# Altium schematic sheet Power.SchDoc
size A2
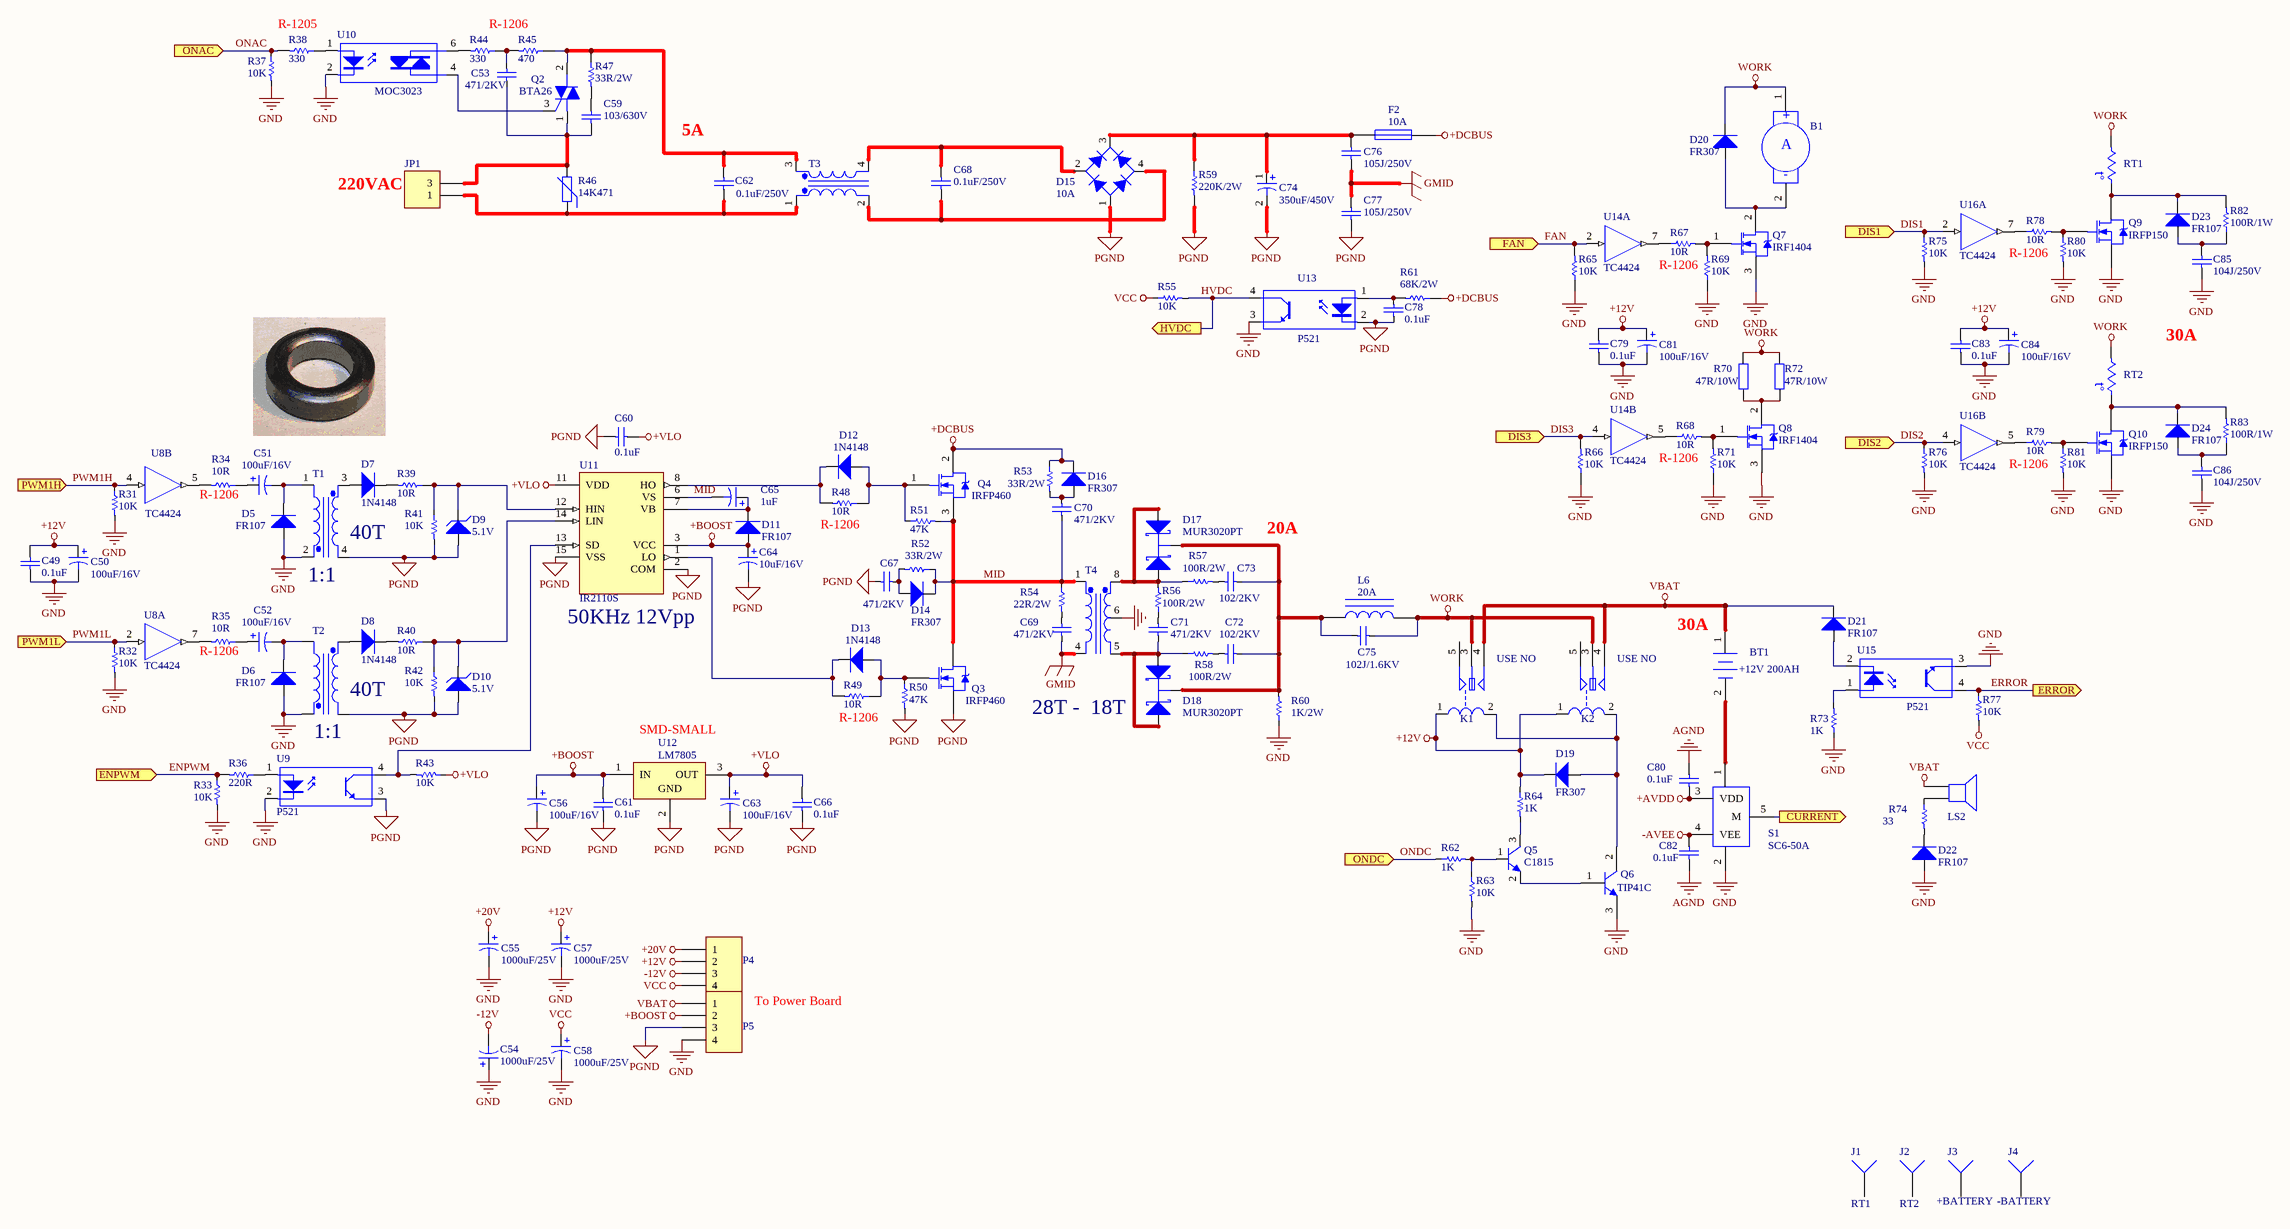
[diagram p0: Power.SchDoc]

## Parts
B1  COOLER  [H2-15A]  (value not drawn)
BT1  value +12V 200AH  [H2-15A]  (hidden comment: Battery)
C49  0.1uF  [C0805]
C50  100uF/16V  [C107-SMD]
C51  100uF/16V  [CAP-100UF/16V]
C52  100uF/16V  [CAP-100UF/16V]
C53  471/2KV  [CAP2/3]
C54  1000uF/25V  [C-400]
C55  1000uF/25V  [C-400]
C56  100uF/16V  [C107-SMD]
C57  1000uF/25V  [C-400]
C58  1000uF/25V  [C-400]
C59  103/630V  [CAP2/3]
C60  0.1uF  [C0805]
C61  0.1uF  [R0805]
C62  0.1uF/250V  [CAP-105J/250V]
C63  100uF/16V  [C107-SMD]
C64  10uF/16V  [C106-SMD]
C65  1uF  [C106-SMD]
C66  0.1uF  [R0805]
C67  471/2KV  [CAP2/3]
C68  0.1uF/250V  [CAP-105J/250V]
C69  471/2KV  [CAP2/3]
C70  471/2KV  [CAP2/3]
C71  471/2KV  [CAP2/3]
C72  102/2KV  [CAP2/3]
C73  102/2KV  [CAP2/3]
C74  350uF/450V  [CAP-330uH-450V]
C75  102J/1.6KV  [CAP200]
C76  105J/250V  [CAP800]
C77  105J/250V  [CAP800]
C78  0.1uF  [C0805]
C79  0.1uF  [C0805]
C80  0.1uF  [R0805]
C81  100uF/16V  [C107-SMD]
C82  0.1uF  [R0805]
C83  0.1uF  [C0805]
C84  100uF/16V  [C107-SMD]
C85  104J/250V  [CAP2/3]
C86  104J/250V  [CAP2/3]
D5  FR107  [DIODE-1A/300]
D6  FR107  [DIODE-1A/300]
D7  1N4148  [1N4148-SMD]
D8  1N4148  [1N4148-SMD]
D9  5.1V  [1N4148]
D10  5.1V  [1N4148]
D11  FR107  [DIODE-1A/300]
D12  1N4148  [1N4148-SMD]
D13  1N4148  [1N4148-SMD]
D14  FR307  [FR307]
D15  10A  [DB-10A]
D16  FR307  [FR307]
D17  MUR3020PT  [TO-247-OUTLINE]
D18  MUR3020PT  [TO-247-OUTLINE]
D19  FR307  [FR307]
D20  FR307  [FR307]
D21  FR107  [DIODE-1A/300]
D22  FR107  [DIODE-1A/300]
D23  FR107  [DIODE-1A/300]
D24  FR107  [DIODE-1A/300]
F2  10A  [FUSE-DC]
J1  RT1  [M4-ON]
J2  RT2  [M4-ON]
J3  +BATTERY  [M4-ON]
J4  -BATTERY  [M4-ON]
JP1  AC in  [H3-15A]  (value not drawn)
K1  RELAY30A  [RELAY30A]  (value not drawn)
K2  RELAY30A  [RELAY30A]  (value not drawn)
L6  value 20A  [IND-10A]  (hidden comment: Inductor Iron)
LS2  Speaker  [BEEPER]  (value not drawn)
P4  Header 4  [H4-15A]  (value not drawn)
P5  Header 4  [H4-15A]  (value not drawn)
Q2  BTA26  [TOP3]
Q3  IRFP460  [TO-247-OUTLINE]
Q4  IRFP460  [TO-247-OUTLINE]
Q5  C1815  [SOT-23]
Q6  TIP41C  [TO-220-FULL OUTLINE]
Q7  IRF1404  [TO-220-FULL OUTLINE]
Q8  IRF1404  [TO-220-FULL OUTLINE]
Q9  IRFP150  [TO-247-OUTLINE]
Q10  IRFP150  [TO-247-OUTLINE]
R31  10K  [R0805]
R32  10K  [R0805]
R33  10K  [R0805]
R34  10R  [R0805]
R35  10R  [R0805]
R36  220R  [R0805]
R37  10K  [R0805]
R38  330  [R0805]
R39  10R  [R0805]
R40  10R  [R0805]
R41  10K  [R0805]
R42  10K  [R0805]
R43  10K  [R0805]
R44  330  [R0805]
R45  470  [R0805]
R46  14K471  [MOV471]
R47  33R/2W  [RES-2W/200]
R48  10R  [R0805]
R49  10R  [R0805]
R50  47K  [R0805]
R51  47K  [R0805]
R52  33R/2W  [RES-2W/200]
R53  33R/2W  [RES-2W/200]
R54  22R/2W  [RES-2W/200]
R55  10K  [R0805]
R56  100R/2W  [RES-2W/200]
R57  100R/2W  [RES-2W/400]
R58  100R/2W  [RES-2W/400]
R59  220K/2W  [RES-2W/400]
R60  1K/2W  [RES-2W/200]
R61  68K/2W  [RES-2W/400]
R62  1K  [R0805]
R63  10K  [R0805]
R64  1K  [R0805]
R65  10K  [R0805]
R66  10K  [R0805]
R67  10R  [R1206]
R68  10R  [R1206]
R69  10K  [R0805]
R70  47R/10W  [RES-10W]
R71  10K  [R0805]
R72  47R/10W  [RES-10W]
R73  1K  [R0805]
R74  33  [R0805]
R75  10K  [R0805]
R76  10K  [R0805]
R77  10K  [R0805]
R78  10R  [R1206]
R79  10R  [R1206]
R80  10K  [R0805]
R81  10K  [R0805]
R82  100R/1W  [RES-1W/110]
R83  100R/1W  [RES-1W/110]
RT1  Res Thermal  [H2-15A]  (value not drawn)
RT2  Res Thermal  [H2-15A]  (value not drawn)
S1  SC6-50A  [SC6-50A]
T1  Trans Cupl  [TRANS-Driver]  (value not drawn)
T2  Trans Cupl  [TRANS-Driver]  (value not drawn)
T3  Filter AC  [IND-10A-4PIN]  (value not drawn)
T4  Trans CT Ideal  [TRANS-F]  (value not drawn)
U8  TC4424  [8-SOIC_751]  (parts A,B of 2)
U9  P521  [DIP-4]
U10  MOC3023  [DIP-6/300]
U11  IR2110S  [SOIC16_N]
U12  LM7805  [78M05-SMD]
U13  P521  [DIP-4]
U14  TC4424  [8-SOIC_751]  (parts A,B of 2)
U15  P521  [DIP-4]
U16  TC4424  [8-SOIC_751]  (parts A,B of 2)

## Ports
CURRENT (out), DIS1 (in), DIS2 (in), DIS3 (in), ENPWM (in), ERROR (out), FAN (in), HVDC (out), ONAC (in), ONDC (in), PWM1H (in), PWM1L (in)

## Nets
+12V: C49.1 C50.1 C57.1 C79.1 C81.1 C83.1 C84.1 D19.2(K) K1.1(V1) K2.1(V1) P4.2 R64.1 U8.6(VCC) U14.6(VCC) U16.6(VCC)
+20V: C55.1 P4.1
+AVDD: C80.2 S1.3(VDD)
+BOOST: C56.1 C61.1 C64.1 D11.1(A) P5.2 U11.3(VCC) U12.1(IN)
+DCBUS: D16.2(K) F2.1 Q4.2(D) R53.1 R61.1
+VLO: C60.1 C63.1 C66.1 R43.1 U11.11(VDD) U12.3(OUT)
-12V: C54.2 P4.3
-AVEE: C82.1 S1.4(VEE)
AGND: C80.1 C82.2
GMID: C69.1 C76.2 C77.1 T4.4(Pri-)
GND: C49.2 C50.2 C54.1 C55.2 C57.2 C58.2 C79.2 C81.2 C83.2 C84.2 C85.1 C86.1 D5.1(A) D6.1(A) D22.1(A) P5.4 Q6.3(E) Q7.3(S) Q8.3(S) Q9.3(S) Q10.3(S) R31.2 R32.2 R33.2 R37.2 R60.1 R63.2 R65.1 R66.1 R69.1 R71.1 R73.1 R75.2 R76.2 R80.2 R81.2 S1.2 T1.2(Pri-) T2.2(Pri-) T4.6(SecCT) U8.3(GND) U9.2(K) U10.2(K) U13.3(E) U14.3(GND) U15.3(E) U16.3(GND)
PGND: C56.2 C60.2 C61.2 C63.2 C64.2 C66.2 C67.1 C74.2 C77.2 C78.2 D9.1(A) D10.1(A) D15.1(A) P5.3 Q3.3(S) R41.2 R42.2 R50.2 R59.2 T1.4(Sec-) T2.4(Sec-) U9.3(E) U11.2(COM) U11.15(VSS) U12.2(GND) U13.2(K)
VBAT: BT1.1(+) D21.2(K) K1.4(NO) K2.4(NO) LS2.1 P5.1
VCC: C58.1 P4.4 R55.1 R77.2
WORK: B1.1(+) C75.1 D20.2(K) K1.3(COM) K2.3(COM) L6.2 R70.2 R72.2 RT1.2 RT2.2
CURRENT: S1.5(M) ; port CURRENT
DIS1: R75.1 U16.2(INA) ; port DIS1
DIS2: R76.1 U16.4(INB) ; port DIS2
DIS3: R66.2 U14.4(INB) ; port DIS3
ENPWM: R33.1 R36.2 ; port ENPWM
ERROR: R77.1 U15.4(C) ; port ERROR
FAN: R65.2 U14.2(INA) ; port FAN
HVDC: R55.2 U13.4(C) ; port HVDC
MID: C65.2 C70.1 D14.2(K) Q3.2(D) Q4.3(S) R51.2 R52.1 R54.1 T4.1(Pri+) U11.6(VS)
ONAC: R37.1 R38.2 ; port ONAC
ONDC: R62.1 ; port ONDC
PWM1H: R31.1 U8.4(INB) ; port PWM1H
PWM1L: R32.1 U8.2(INA) ; port PWM1L
NetB1_2: B1.2(-) D20.1(A) Q7.2(D)
NetBT1_2: BT1.2(-) S1.1
NetC51_1: C51.1 R34.1
NetC51_2: C51.2 D5.2(K) T1.1(Pri+)
NetC52_1: C52.1 R35.1
NetC52_2: C52.2 D6.2(K) T2.1(Pri+)
NetC53_1: C53.1 C59.2 JP1.3 Q2.1(M1) R46.2
NetC53_2: C53.2 R44.1 R45.2
NetC59_1: C59.1 R47.2
NetC62_1: C62.1 Q2.2(M2) R45.1 R47.1 T3.3(Sec+)
NetC62_2: C62.2 JP1.1 R46.1 T3.1(Pri+)
NetC65_1: C65.1 D11.2(K) U11.7(VB)
NetC67_2: C67.2 D14.1(A) R52.2
NetC68_1: C68.1 D15.2(C) T3.4(Sec-)
NetC68_2: C68.2 D15.4(C) T3.2(Pri-)
NetC69_2: C69.2 R54.2
NetC70_2: C70.2 D16.1(A) R53.2
NetC71_1: C71.1 R56.1
NetC71_2: C71.2 D18.1(A1) D18.3(A2) R58.1 T4.5(Sec-)
NetC72_1: C72.1 C73.1 C75.2 D17.2(K) D18.2(K) L6.1 R60.2
NetC72_2: C72.2 R58.2
NetC73_2: C73.2 R57.2
NetC74_1: C74.1 C76.1 D15.3(K) F2.2 R59.1
NetC78_1: C78.1 R61.2 U13.1(A)
NetC85_2: C85.2 D23.1(A) R82.1
NetC86_2: C86.2 D24.1(A) R83.1
NetD7_1: D7.1(A) T1.3(Sec+)
NetD7_2: D7.2(K) R39.2
NetD8_1: D8.1(A) T2.3(Sec+)
NetD8_2: D8.2(K) R40.2
NetD9_2: D9.2(K) R39.1 R41.1 U11.12(HIN)
NetD10_2: D10.2(K) R40.1 R42.1 U11.14(LIN)
NetD12_1: D12.1(A) Q4.1(G) R48.1 R51.1
NetD12_2: D12.2(K) R48.2 U11.8(HO)
NetD13_1: D13.1(A) Q3.1(G) R49.1 R50.1
NetD13_2: D13.2(K) R49.2 U11.1(LO)
NetD17_1: D17.1(A1) D17.3(A2) R56.2 R57.1 T4.8(Sec+)
NetD19_1: D19.1(A) K1.2(V2) K2.2(V2) Q6.2(C)
NetD21_1: D21.1(A) U15.2(K)
NetD22_2: D22.2(K) R74.2
NetD23_2: D23.2(K) Q9.2(D) R82.2 RT1.1
NetD24_2: D24.2(K) Q10.2(D) R83.2 RT2.1
NetLS2_2: LS2.2 R74.1
NetQ2_3: Q2.3(G) U10.4(A/K)
NetQ5_1: Q5.1(B) R62.2 R63.1
NetQ5_2: Q5.2(E) Q6.1(B)
NetQ5_3: Q5.3(C) R64.2
NetQ7_1: Q7.1(G) R67.2 R69.2
NetQ8_1: Q8.1(G) R68.2 R71.2
NetQ8_2: Q8.2(D) R70.1 R72.1
NetQ9_1: Q9.1(G) R78.2 R80.1
NetQ10_1: Q10.1(G) R79.2 R81.1
NetR34_2: R34.2 U8.5(OUTB)
NetR35_2: R35.2 U8.7(OUTA)
NetR36_1: R36.1 U9.1(A)
NetR38_1: R38.1 U10.1(A)
NetR43_2: R43.2 U9.4(C) U11.13(SD)
NetR44_2: R44.2 U10.6(A/K)
NetR67_1: R67.1 U14.7(OUTA)
NetR68_1: R68.1 U14.5(OUTB)
NetR73_2: R73.2 U15.1(A)
NetR78_1: R78.1 U16.7(OUTA)
NetR79_1: R79.1 U16.5(OUTB)

Not connected (* = marked no-connect by the designer): J1 1; J2 1; J3 1; J4 1; K1 5(NC); K2 5(NC); U11 4(NC) 5(NC) 9(NC) 10(NC) 16(NC)

## Notes on the sheet
- R-1205
- R-1206
- (near C62) 5A
- 220VAC
- 30A
- (near R34) R-1206
- (near T1) 40T
- (near R48) R-1206
- 20A
- (near T1) 1:1
- (near R35) R-1206
- (near U11) 50KHz 12Vpp
- (near K1) USE NO
- (near K2) USE NO
- (near BT1) 30A
- (near T2) 40T
- (near R49) R-1206
- (near D18) 28T -  18T
- (near T2) 1:1
- (near U12) SMD-SMALL
- To Power Board
- (in symbol Motor Servo) A
- (in symbol Res Thermal) t°

## Library data of the parts
B1 = Motor Servo: Servo Motor; Value: COOLER 12V; Published: 24-Mar-1999; LatestRevisionDate: 17-Jul-2002; LatestRevisionNote: Re-released for DXP Platform.; PackageReference: RAD-0.4; Publisher: Altium Limited
BT1 = Battery: Multicell Battery; Published: 24-Mar-1999; LatestRevisionDate: 17-Jul-2002; LatestRevisionNote: Re-released for DXP Platform.; PackageReference: BAT-2; Publisher: Altium Limited
C49 C53 C60-C62 C66-C73 C75-C80 C82 C83 C85 C86 = Cap: Capacitor; Published: 8-Jun-2000; LatestRevisionDate: 17-Jul-2002; LatestRevisionNote: Re-released for DXP Platform.; PackageReference: RAD-0.3; Publisher: Altium Limited
  C49 C60 C61 C66 C78-C80 C82 C83: Value: 0.1uF
  C53 C67 C69-C71: Value: 471/2KV
  C62 C68: Value: 0.1uF/250V
  C72 C73: Value: 102/2KV
  C75: Value: 102J/1.6KV
  C76 C77: Value: 105J/250V
  C85 C86: Value: 104J/250V
C50-C52 C56 C63 C81 C84 = Cap Pol1: Polarized Capacitor (Radial); Value: 100uF/16V SMD; Published: 8-Jun-2000; LatestRevisionDate: 17-Jul-2002; LatestRevisionNote: Re-released for DXP Platform.; PackageReference: RB7.6-15; Publisher: Altium Limited
C54 C55 C57 C58 C74 = Cap Pol1: Polarized Capacitor (Radial); Published: 8-Jun-2000; LatestRevisionDate: 17-Jul-2002; LatestRevisionNote: Re-released for DXP Platform.; PackageReference: RB7.6-15; Publisher: Altium Limited
  C54 C55 C57 C58: Value: 1000uF/25V
  C74: Value: 350uF/450V
C59 = Cap: Capacitor; Manufacturer: Generic Components; Class: Passive; Published: 08/06/2000; Publisher: Altium Hobart Technology Centre; SubClass: Capacitor; Value: 103/630V
C64 = Cap Pol1: Polarized Capacitor (Radial); Value: 10uF/16V SMD; Published: 8-Jun-2000; LatestRevisionDate: 17-Jul-2002; LatestRevisionNote: Re-released for DXP Platform.; PackageReference: RB7.6-15; Publisher: Altium Limited
C65 = Cap Pol1: Polarized Capacitor (Radial); Value: 1uF/50V SMD; Published: 8-Jun-2000; LatestRevisionDate: 17-Jul-2002; LatestRevisionNote: Re-released for DXP Platform.; PackageReference: RB7.6-15; Publisher: Altium Limited
D5 D6 D11-D14 D16 D19-D24 = Diode 1N4148: High Conductance Fast Diode; Published: 8-Jun-2000; LatestRevisionDate: 17-Jul-2002; LatestRevisionNote: Re-released for DXP Platform.; DatasheetDocument: 1997; PackageReference: DO-35; Publisher: Altium Limited; Code_JEDEC: DO-204-AH; ComponentLink1Description: Manufacturer Link; ComponentLink1URL: http://www.fairchildsemi.com/; ComponentLink2Description: Datasheet; ComponentLink2URL: http://www.fairchildsemi.com/ds/1N%2F1N4148.pdf
  D5 D6 D11 D21-D24: Value: FR107
  D12 D13: Value: 1N4148
  D14 D16 D19 D20: Value: FR307
D7 D8 = Diode 1N4148: High Conductance Fast Diode; Value: 1N4148 SMD; Published: 8-Jun-2000; LatestRevisionDate: 17-Jul-2002; LatestRevisionNote: Re-released for DXP Platform.; DatasheetDocument: 1997; PackageReference: DO-35; Publisher: Altium Limited; Code_JEDEC: DO-204-AH; ComponentLink1Description: Manufacturer Link; ComponentLink1URL: http://www.fairchildsemi.com/; ComponentLink2Description: Datasheet; ComponentLink2URL: http://www.fairchildsemi.com/ds/1N%2F1N4148.pdf
D9 D10 = D Zener: Zener Diode; Value: ZENNER 5.1V; Published: 8-Jun-2000; LatestRevisionDate: 17-Jul-2002; LatestRevisionNote: Re-released for DXP Platform.; PackageReference: DIODE-0.7; Publisher: Altium Limited
D15 = Bridge1: Full Wave Diode Bridge; Published: 8-Jun-2000; LatestRevisionDate: 17-Jul-2002; LatestRevisionNote: Re-released for DXP Platform.; PackageReference: D-38; Publisher: Altium Limited; Value: 10A
D17 D18 = MBR4060PT: Schottky Rectifier; Published: 8-Jun-2000; LatestRevisionDate: 17-Jul-2002; LatestRevisionNote: Re-released for DXP Platform.; DatasheetDocument: PD-2.344; PackageDocument: Aug-1997; PackageReference: TO-247AC; Publisher: Altium Limited; Code_JEDEC: TO-247-AC; ComponentLink1Description: Manufacturer Link; ComponentLink1URL: http://www.irf.com/; Value: MUR3020PT
F2 = Fuse 1: Fuse; Published: 8-Jun-2000; LatestRevisionDate: 17-Jul-2002; LatestRevisionNote: Re-released for DXP Platform.; PackageReference: PIN-W2/E2.8; Publisher: Altium Limited; Value: 10A
J1-J4 = Socket: LatestRevisionDate: 17-Jul-2002; LatestRevisionNote: Re-released for DXP Platform.; Publisher: Altium Limited
JP1 = Header 2: Header, 2-Pin; Manufacturer: Generic Components; Class: Connector; Value: POWER CONNECTOR
L6 = Inductor Iron: Magnetic-Core Inductor; Published: 24-Mar-1999; LatestRevisionDate: 17-Jul-2002; LatestRevisionNote: Re-released for DXP Platform.; PackageReference: AXIAL-0.9; Publisher: Altium Limited
LS2 = Speaker: Loudspeaker; Value: Beep; Published: 24-Mar-1999; LatestRevisionDate: 17-Jul-2002; LatestRevisionNote: Re-released for DXP Platform.; PackageReference: PIN2; Publisher: Altium Limited
P4 P5 = Header 4: Header, 4-Pin; LatestRevisionDate: 17-Jul-2002; LatestRevisionNote: Re-released for DXP Platform.; Publisher: Altium Limited
Q2 = Triac: Silicon Bidirectional Triode Thyristor; Note: Pin 2 is electrically connected to Pin 4 (TAB); Published: 29-Sep-2000; LatestRevisionDate: 17-Jul-2002; LatestRevisionNote: Re-released for DXP Platform.; DatasheetDocument: 1999; PackageReference: 369-03; Publisher: Altium Limited; Code_JEDEC: TO-251-AA; ComponentLink1Description: Manufacturer Link; ComponentLink1URL: http://www.motorola.com/; Value: BTA26
Q3 Q4 = IRFP460: HEXFET Power MOSFET; Note: Pin 2 is electrically connected to the Heatsink (4).; Published: 8-Jun-2000; LatestRevisionDate: 17-Jul-2002; LatestRevisionNote: Re-released for DXP Platform.; DatasheetVersion: PD-9.512B; PackageVersion: Aug-1997; PackageReference: TO-247AC; Publisher: Altium Limited; PackageDescription: SIP with Mounting Hole; 3 Leads; Body 20 x 15.6 x 5 mm (typ); Pitch 5.45 mm; Code_JEDEC: TO-247-AC; ComponentLink1Description: Manufacturer Link; ComponentLink1URL: http://www.irf.com/; ComponentLink2Description: Datasheet; ComponentLink2URL: http://www.irf.com/product-info/datasheets/data/irfp460.pdf; Value: IRFP460
Q5 Q6 = 2N3904: NPN General Purpose Amplifier; Published: 8-Jun-2000; LatestRevisionDate: 15-Jan-2003; LatestRevisionNote: PCB Footprint 'BCY-W3/D4.7' replaced; DatasheetDocument: 1997; PackageDocument: Sep-1998; PackageReference: TO-92A; Publisher: Altium Limited; Code_JEDEC: TO-92A; ComponentLink1Description: Manufacturer Link; ComponentLink1URL: http://www.fairchildsemi.com/; ComponentLink2Description: Datasheet; ComponentLink2URL: http://www.fairchildsemi.com/ds/2N%2F2N3904.pdf
  Q5: value: C1815
  Q6: value: TIP41C
Q7-Q10 = IRF1404: HEXFET Power MOSFET; Note: Pin 2 is electrically connected to Tab (Drain).; Published: 17-Sep-2003; DatasheetVersion: 20-Oct-2000; PackageVersion: Feb-1997; PackageReference: TO-220AB; Publisher: Altium Limited; PackageDescription: TO, Thru-Hole, Vertical, Heatsink Mounted; 3 In-Line Leads; Pitch 2.54 mm; ComponentLink1Description: Manufacturer Link; ComponentLink1URL: http://www.irf.com/; ComponentLink2Description: Datasheet; ComponentLink2URL: http://www.irf.com/product-info/datasheets/data/irfs31n20d.pdf
  Q7 Q8: Value: IRF1404
  Q9 Q10: Value: IRFP150
R31-R37 R39-R43 R48-R69 R71 R73-R83 = Res1: Resistor; Published: 8-Jun-2000; LatestRevisionDate: 17-Jul-2002; LatestRevisionNote: Re-released for DXP Platform.; PackageReference: AXIAL-0.3; Publisher: Altium Limited
  R31-R33 R37 R41-R43 R55 R63 R65 R66 R69 R71 R75-R77 R80 R81: Value: 10K
  R34 R35 R39 R40 R48 R49 R67 R68 R78 R79: Value: 10R
  R36: Value: 220R
  R50 R51: Value: 47K
  R52 R53: Value: 33R/2W
  R54: Value: 22R/2W
  R56-R58: Value: 100R/2W
  R59: Value: 220K/2W
  R60: Value: 1K/2W
  R61: Value: 68K/2W
  R62 R64 R73: Value: 1K
  R74: Value: 33
  R82 R83: Value: 100R/1W
R38 R44 R45 R47 = Res1: Resistor; Manufacturer: Generic Components; Class: Passive; Published: 08/06/2000; Publisher: Altium Hobart Technology Centre; SubClass: Resistor
  R38 R44: Value: 330
  R45: Value: 470
  R47: Value: 33R/2W
R46 = Res Varistor: Varistor (Voltage-Sensitive Resistor); Published: 24-Mar-1999; LatestRevisionDate: 04-Mar-2005; LatestRevisionNote: PCB Footprint replaced.; PackageReference: 6-0805; Publisher: Altium Limited; Value: 14K471
R70 R72 = Res2: Resistor; Published: 8-Jun-2000; LatestRevisionDate: 17-Jul-2002; LatestRevisionNote: Re-released for DXP Platform.; PackageReference: AXIAL-0.4; Publisher: Altium Limited; Value: 47R/10W
RT1 RT2 = Res Thermal: Thermistor; Published: 24-Mar-1999; LatestRevisionDate: 04-Mar-2005; LatestRevisionNote: PCB Footprint replaced.; PackageReference: 6-0805; Publisher: Altium Limited
S1 = HALL: Shunt Resistor; Value: SC6-50A
T1 T2 = Trans Cupl: Transformer (Coupled Inductor Model); Published: 8-Jun-2000; LatestRevisionDate: 17-Jul-2002; LatestRevisionNote: Re-released for DXP Platform.; PackageReference: TRF_4; Publisher: Altium Limited
T3 = Trans Ideal: Transformer (Ideal); Published: 8-Jun-2000; LatestRevisionDate: 17-Jul-2002; LatestRevisionNote: Re-released for DXP Platform.; PackageReference: TRF_4; Publisher: Altium Limited; Value: Filter AC
T4 = Trans CT Ideal: Center-Tapped Transformer (Ideal); Value: MainTrans; Published: 8-Jun-2000; LatestRevisionDate: 17-Jul-2002; LatestRevisionNote: Re-released for DXP Platform.; PackageReference: TRF_5; Publisher: Altium Limited
U8 U14 U16 = TC4427EAPA: 1.5A Dual High-Speed Power MOSFET Driver, Non-Inverting, Industrial Temperature; Value: TC4424
U9 U13 U15 = Optoisolator1: 4-Pin Phototransistor Optocoupler; Published: 24-Mar-1999; LatestRevisionDate: 04-Mar-2005; LatestRevisionNote: Sch pins 3 & 4 Swapped.; DatasheetDocument: Nov-2003; PackageReference: DIP-4; Publisher: Altium Limited; Value: P521
U10 = Opto TRIAC: Opto-Triac; Published: 24-Mar-1999; LatestRevisionDate: 17-Jul-2002; LatestRevisionNote: Re-released for DXP Platform.; PackageReference: NPSIP4A; Publisher: Altium Limited; Value: MOC3023
U11 = IR2110S: High and Low Side Driver; Note: Pins 4, 5, 9, 10 and 16 are not connected; Published: 8-Jun-2000; LatestRevisionDate: 13-Apr-2006; LatestRevisionNote: IPC-7351 Footprint Added.; DatasheetVersion: PD60147J; PackageReference: SOIC16; Publisher: Altium Limited; PackageDescription: 16-Pin Small Outline Integrated Circuit 1.27 mm Pitch; Code_JEDEC: MS-013-AA; Code_IPC: SOIC127P1030-16; ComponentLink1Description: Manufacturer Link; ComponentLink1URL: http://www.irf.com/; ComponentLink2Description: Datasheet; ComponentLink2URL: http://www.irf.com/product-info/datasheets/data/ir2110.pdf
U12 = MC7805CT: 3-Terminal Positive Fixed Voltage Regulator; Note: Pin 2 is electrically connected to TAB; Published: 17-Jul-2002; DatasheetVersion: 1988; PackageReference: 221A-04; Publisher: Altium Limited; PackageDescription: TO, Thru-Hole, Vertical, Heatsink Mounted; 3 In-Line Leads; Pitch 2.54 mm; Code_JEDEC: TO-262-AA; ComponentLink1Description: Manufacturer Link; ComponentLink1URL: http://www.onsemi.com/site/products/taxonomy/0,4438,503,00.html; ComponentLink2Description: Datasheet; ComponentLink2URL: http://www.onsemi.com/pub/Collateral/MC7800-D.PDF; value: LM7805
K1 K2 = RELAY30A: value: RELAY30A